# EAGLE schematic Main_Board (EAGLE 6.4)
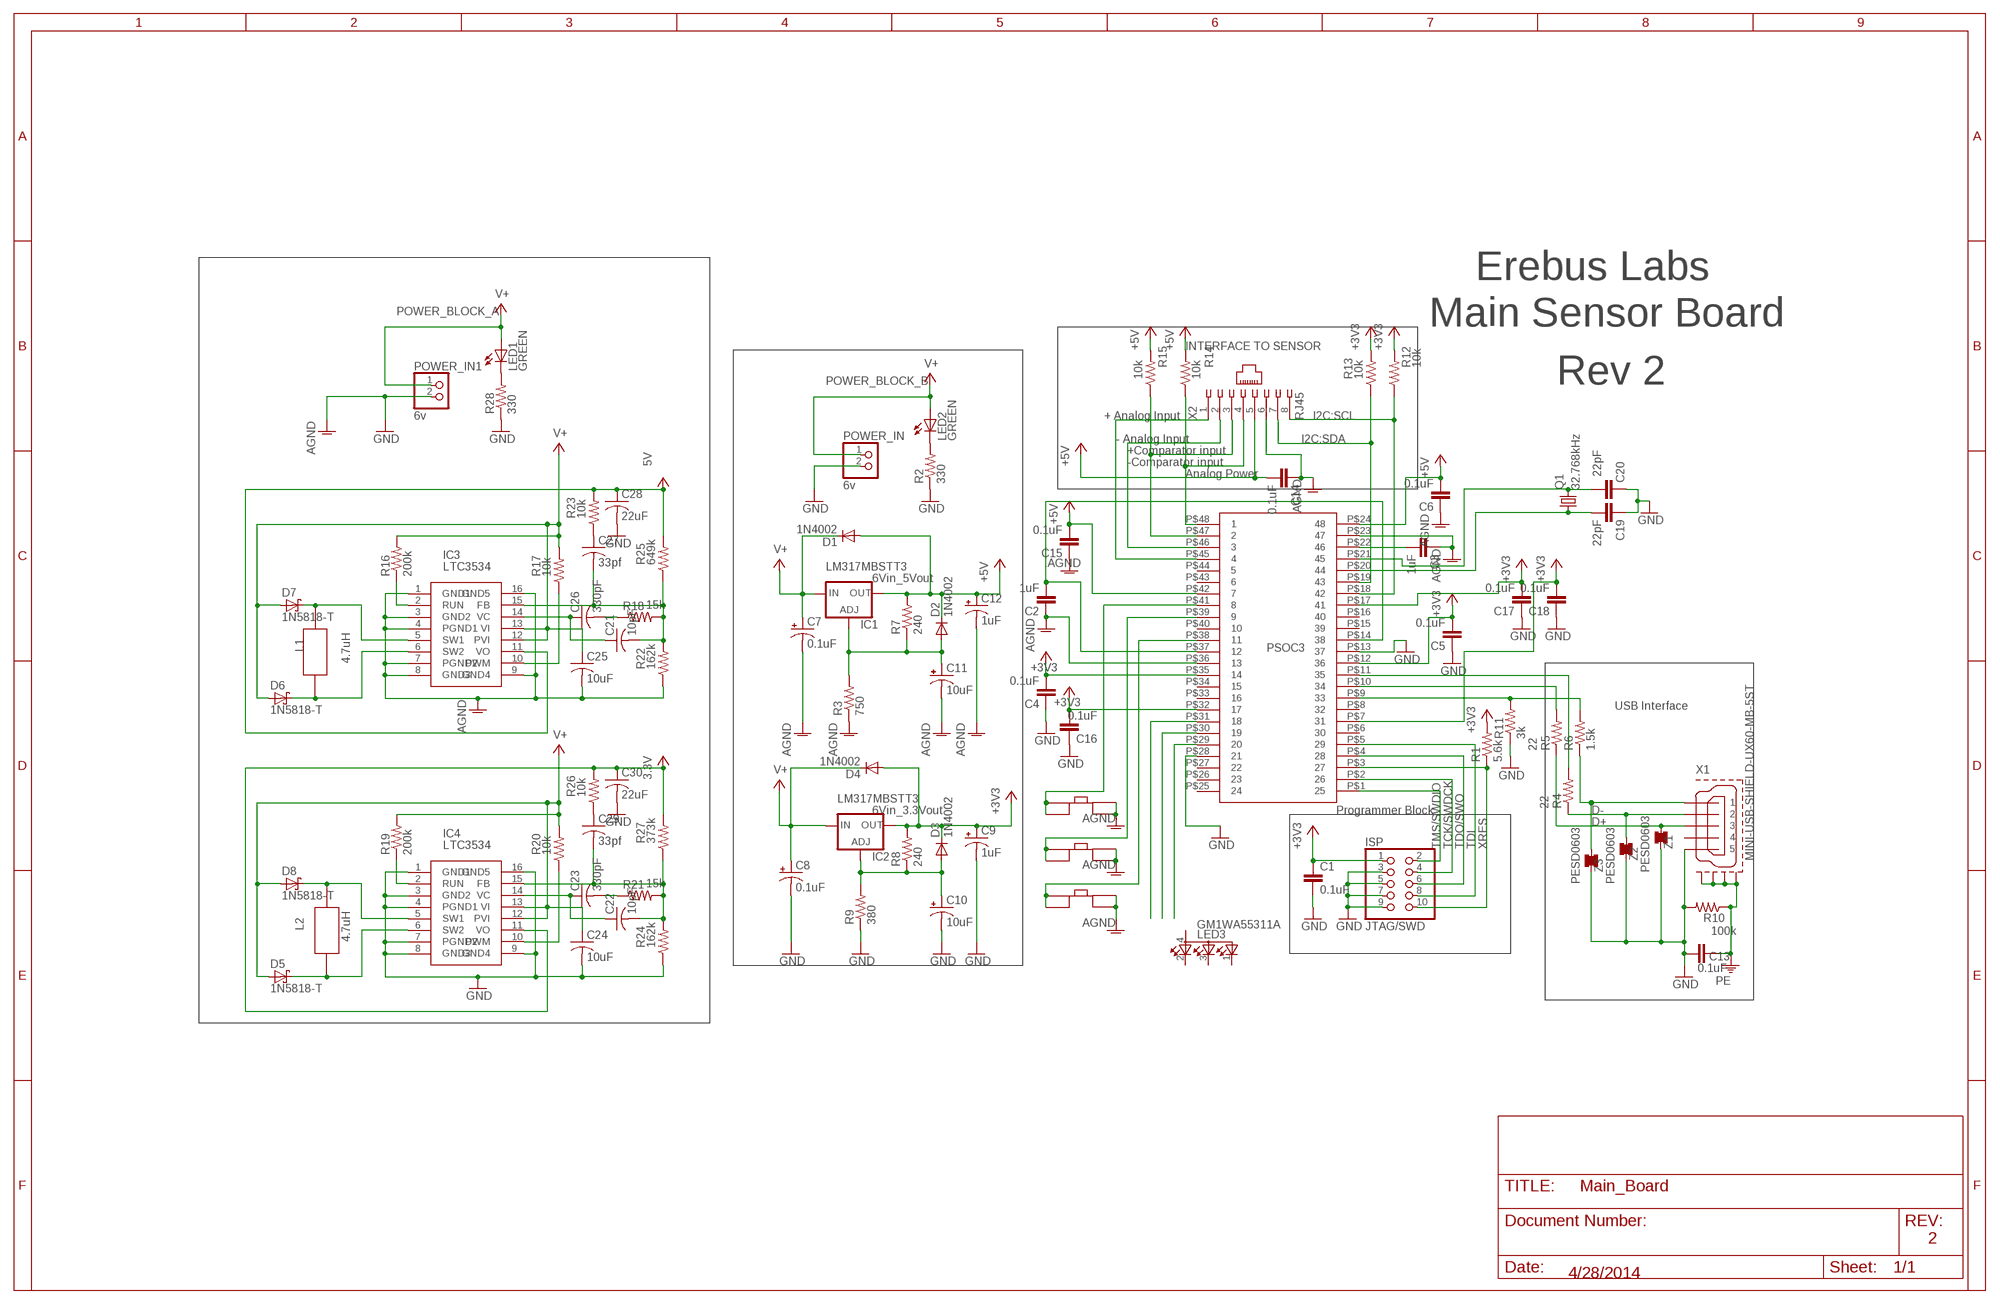
[diagram p0: schematic, sheet 1]

## Parts
C1  0.1uF  C-EUC0603K  [C0603K]
C2  1uF  C-EUC0603  [C0603]
C3  1uF  C-EUC0603  [C0603]
C4  0.1uF  C-EUC0603K  [C0603K]
C5  0.1uF  C-EUC0603K  [C0603K]
C6  0.1uF  C-EUC0603K  [C0603K]
C7  0.1uF  CPOL-USE2-5  [E2-5]
C8  0.1uF  CPOL-USE2-5  [E2-5]
C9  1uF  CPOL-USE2-5  [E2-5]
C10  10uF  CPOL-USE2-5  [E2-5]
C11  10uF  CPOL-USE2-5  [E2-5]
C12  1uF  CPOL-USE2-5  [E2-5]
C13  0.1uF  C-EUC0603K  [C0603K]
C14  0.1uF  C-EUC0603K  [C0603K]
C15  0.1uF  C-EUC0603K  [C0603K]
C16  0.1uF  C-EUC0603K  [C0603K]
C17  0.1uF  C-EUC0603K  [C0603K]
C18  0.1uF  C-EUC0603K  [C0603K]
C19  22pF  C-EUC0603  [C0603]
C20  22pF  C-EUC0603  [C0603]
C21  10pF  C-USC0805  [C0805]
C22  10pF  C-USC0805  [C0805]
C23  330pF  C-USC0805  [C0805]
C24  10uF  C-USC0805  [C0805]
C25  10uF  C-USC0805  [C0805]
C26  330pF  C-USC0805  [C0805]
C27  33pf  C-USC0805  [C0805]
C28  22uF  C-USC0805  [C0805]
C29  33pf  C-USC0805  [C0805]
C30  22uF  C-USC0805  [C0805]
D1  1N4002  DIODE-DO41-7.6  [DO41-7.6]
D2  1N4002  DIODE-DO41-7.6  [DO41-7.6]
D3  1N4002  DIODE-DO41-7.6  [DO41-7.6]
D4  1N4002  DIODE-DO41-7.6  [DO41-7.6]
D5  1N5818-T  [DO41-7.6]
D6  1N5818-T  [DO41-7.6]
D7  1N5818-T  [DO41-7.6]
D8  1N5818-T  [DO41-7.6]
IC1  LM317MBSTT3  [SOT223]
IC2  LM317MBSTT3  [SOT223]
ISP  JTAG/SWD  PINHD-2X5/90  [2X05/90]
L1  4.7uH  SHEILDED_COIL  [SHEILDED_COIL]
L2  4.7uH  SHEILDED_COIL  [SHEILDED_COIL]
LED1  GREEN  LED5MM  [LED5MM]
LED2  GREEN  LED5MM  [LED5MM]
LED3  GM1WA55311A  [GM1WA55311A]
POWER_IN  6v  PINHD-1X2  [1X02]
POWER_IN1  6v  PINHD-1X2  [1X02]
Q1  32.768kHz  CRYSTALTC38H  [TC38H]
R1  5.6k  R-US_R0805  [R0805]
R2  330  R-US_R0603  [R0603]
R3  750  R-US_M1206  [M1206]
R4  22  R-US_R0603  [R0603]
R5  22  R-US_R0603  [R0603]
R6  1.5k  R-US_R0805  [R0805]
R7  240  R-US_M1206  [M1206]
R8  240  R-US_M1206  [M1206]
R9  380  R-US_M1206  [M1206]
R10  100k  R-US_R0805  [R0805]
R11  3k  R-US_R0805  [R0805]
R12  10k  R-US_R0805  [R0805]
R13  10k  R-US_R0805  [R0805]
R14  10k  R-US_R0805  [R0805]
R15  10k  R-US_R0805  [R0805]
R16  200k  R-US_R1206  [R1206]
R17  10k  R-US_R0805  [R0805]
R18  15k  R-US_R0805  [R0805]
R19  200k  R-US_R1206  [R1206]
R20  10k  R-US_R0805  [R0805]
R21  15k  R-US_R0805  [R0805]
R22  162k  R-US_R0805  [R0805]
R23  10k  R-US_R0805  [R0805]
R24  162k  R-US_R0805  [R0805]
R25  649k  R-US_R0805  [R0805]
R26  10k  R-US_R0805  [R0805]
R27  373k  R-US_R0805  [R0805]
R28  330  R-US_R0603  [R0603]
U$1  PSOC_3_48PIN_SSOP  [PSOC_3_48PIN_SSOP]
U$2  SWITCHER  [SSOP16]
U$3  SWITCHER  [SSOP16]
U$4  SPST  [SPST]
U$5  SPST  [SPST]
U$6  SPST  [SPST]
X1  MINI-USB-SHIELD-UX60-MB-5ST  [UX60-MB-5ST]
X2  RJ45  555167-1  [555167-1]
Z1  PESD0603  [SMD-0603]
Z2  PESD0603  [SMD-0603]
Z3  PESD0603  [SMD-0603]

## Nets
+3V3: C1.1 C4.2 C5.2 C9.+ C17.2 C18.2 D3.C D4.A IC2.4(OUT) ISP.1 R1.2 R8.2 R12.2 R13.2 U$1.P$7 U$1.P$12 U$1.P$17 U$1.P$35
+5V: C6.2 C12.+ C14.2 C15.2 C16.2 D1.A D2.C IC1.4(OUT) R7.2 R14.2 R15.2 U$1.P$24 U$1.P$32 U$1.P$42 X2.5 ; supply symbol labelled +3V3
AGND: C13.1 R10.1 U$4.B1 U$4.B2 U$5.B1 U$5.B2 U$6.B1 U$6.B2 X1.M1(GND1) X1.M2(GND2) X1.M3(GND3) X1.M4(GND4) ; supply symbol labelled PE
ANALOGINPUT: U$1.P$46 X2.2
GND: C1.2 C2.1 C3.1 C4.1 C5.1 C6.1 C7.- C8.- C9.- C10.- C11.- C12.- C13.2 C14.1 C15.1 C16.1 C17.1 C18.1 C19.1 C20.1 C24.2 C25.2 C28.2 C30.2 ISP.3 ISP.5 ISP.7 ISP.9 POWER_IN1.2 POWER_IN.2 R2.1 R3.1 R9.1 R10.2 R11.1 R22.1 R24.1 R28.1 U$1.P$13 U$1.P$23 U$1.P$28 U$1.P$36 U$2.1(GND1) U$2.3(GND2) U$2.4(PGND1) U$2.7(PGND2) U$2.8(GND3) U$2.9(GND4) U$2.16(GND5) U$3.1(GND1) U$3.3(GND2) U$3.4(PGND1) U$3.7(PGND2) U$3.8(GND3) U$3.9(GND4) U$3.16(GND5) X1.5 X2.6 Z1.1 Z2.1 Z3.1 ; supply symbol labelled AGND
N$1: R4.2 U$1.P$11
N$2: R5.2 U$1.P$10
N$3: R6.2 R11.2 U$1.P$9
N$4: ISP.2 U$1.P$1
N$5: ISP.4 U$1.P$2
N$6: ISP.6 U$1.P$4
N$7: ISP.8 U$1.P$5
N$8: ISP.10 R1.1 U$1.P$3
N$9: C2.2 U$1.P$14 U$1.P$37
N$10: C11.+ D2.A IC1.1(ADJ) R3.2 R7.1
N$11: C3.2 U$1.P$22
N$12: LED2.K(C) R2.2
N$13: R5.1 X1.3 Z1.2
N$14: R4.1 X1.2 Z2.2
N$15: C10.+ D3.A IC2.1(ADJ) R8.1 R9.2
N$16: C20.2 Q1.2 U$1.P$21
N$17: R6.1 X1.1 Z3.2
N$18: R15.1 U$1.P$47 X2.3
N$19: R14.1 U$1.P$48 X2.4
N$20: R13.1 U$1.P$19 X2.7
N$21: R12.1 U$1.P$18 X2.8
N$23: C19.2 Q1.1 U$1.P$20
N$24: C21.1 C26.1 U$2.14(VC)
N$25: R16.1 U$2.2(RUN)
N$26: D7.C L1.P$2 U$2.5(SW1)
N$27: R17.1 U$2.10(PWM)
N$28: D6.C L1.P$1 U$2.6(SW2)
N$29: C26.2 R18.1
N$30: C21.2 C27.2 R18.2 R22.2 R25.1 U$2.15(FB)
N$31: C27.1 R23.1
N$32: R19.1 U$3.2(RUN)
N$33: R20.1 U$3.10(PWM)
N$34: D8.C L2.P$2 U$3.5(SW1)
N$35: D5.C L2.P$1 U$3.6(SW2)
N$36: C22.1 C23.1 U$3.14(VC)
N$37: C23.2 R21.1
N$38: C22.2 C29.2 R21.2 R24.2 R27.1 U$3.15(FB)
N$39: C29.1 R26.1
N$40: LED1.K(C) R28.2
N$41: U$1.P$39 U$5.A1 U$5.A2
N$42: U$1.P$45 X2.1
N$43: U$1.P$31
N$44: U$1.P$38 U$6.A1 U$6.A2
N$45: U$1.P$41 U$4.A1 U$4.A2
N$46: U$1.P$30
N$47: U$1.P$29
V+: C7.+ C8.+ C24.1 C25.1 C28.1 C30.1 D1.C D4.C D5.A D6.A D7.A D8.A IC1.3(IN) IC2.3(IN) LED1.A LED2.A POWER_IN1.1 POWER_IN.1 R16.2 R17.2 R19.2 R20.2 R23.2 R25.2 R26.2 R27.2 U$2.11(VO) U$2.12(PVI) U$2.13(VI) U$3.11(VO) U$3.12(PVI) U$3.13(VI) ; supply symbol labelled 5V, 3.3V
Unconnected: LED3.1(CGREEN) LED3.2(CRED) LED3.3(CBLUE) LED3.4(A) U$1.P$6 U$1.P$8 U$1.P$15 U$1.P$16 U$1.P$25 U$1.P$26 U$1.P$27 U$1.P$33 U$1.P$34 U$1.P$40 U$1.P$43 U$1.P$44 X1.4

## Notes on the sheet
- Erebus Labs
- POWER_BLOCK_A
- Main Sensor Board
- INTERFACE TO SENSOR
- POWER_BLOCK_B | Rev 2
- + Analog Input | I2C:SCL
- - Analog Input | I2C:SDA
- +Comparator input
- -Comparator input
- Analog Power
- IC3
- LTC3534
- 6Vin_5Vout
- L1 | PSOC3
- 4.7uH
- USB Interface
- 6Vin_3.3Vout | Programmer Block | D-
- D+
- IC4
- LTC3534 | TMS/SWDIO | TCK/SWDCK | TDO/SWO | TDI | XRES
- L2
- 4.7uH
- 2
- 4/28/2014

## Library data of the parts
C1-C6 C13-C20 = rcl:C-EU: CAPACITOR, European symbol
C7-C12 = rcl:CPOL-US: POLARIZED CAPACITOR, American symbol
C21-C30 = rcl:C-US: CAPACITOR, American symbol
D1-D4 = diode:DIODE-: DIODE
D5-D8 = diode:1N581*: 1.0A SCHOTTKY BARRIER RECTIFIER Source: http://www.diodes.com/datasheets/ds23001.pdf
IC1 IC2 = v-reg:LM317?*: 500 mA Adjustable Output Positive Voltage Regulator Source: http://www.onsemi.co.jp .. LM317M-D.PDF
ISP = pinhead:PINHD-2X5: PIN HEADER
L1 L2 = Inductor:SHEILDED_COIL
LED1 LED2 = led:LED: LED OSRAM: - CHIPLED LG R971, LG N971, LY N971, LG Q971, LY Q971, LO R971, LY R971 LH N974, LH R974 LS Q976, LO Q976, LY Q976 LO Q996 - Hyper CHIPLED LW Q18S LB Q993, LB Q99A, LB R99A - SideLED LS A670, LO A670, LY A670, LG A670, LP A670 LB A673, LV A673, LT A673, LW A673 LH A674 LY A675 LS A676, LA A676, LO A676, LY A676, LW A676 LS A679, LY A679, LG A679 - Hyper Micro SIDELED® LS Y876, LA Y876, LO Y876, LY Y876 LT Y87S - SmartLED LW L88C, LW L88S LB L89C, LB L89S, LG L890 LS L89K, LO L89K, LY L89K LS L896, LA L896, LO L896, LY L896 - TOPLED LS T670, LO T670, LY T670, LG T670, LP T670 LSG T670, LSP T670, LSY T670, LOP T670, LYG T670 LG T671, LOG T671, LSG T671 LB T673, LV T673, LT T673, LW T673 LH T674 LS T676, LA T676, LO T676, LY T676, LB T676, LH T676, LSB T676, LW T676 LB T67C, LV T67C, LT T67C, LS T67K, LO T67K, LY T67K, LW E67C LS E67B, LA E67B, LO E67B, LY E67B, LB E67C, LV E67C, LT E67C LW T67C LS T679, LY T679, LG T679 LS T770, LO T770, LY T770, LG T770, LP T770 LB T773, LV T773, LT T773, LW T773 LH T774 LS E675, LA E675, LY E675, LS T675 LS T776, LA T776, LO T776, LY T776, LB T776 LHGB T686 LT T68C, LB T68C - Hyper Mini TOPLED® LB M676 - Mini TOPLED Santana® LG M470 LS M47K, LO M47K, LY M47K Source: http://www.osram.convergy.de LUXEON: - LUMILED® LXK2-PW12-R00, LXK2-PW12-S00, LXK2-PW14-U00, LXK2-PW14-V00 LXK2-PM12-R00, LXK2-PM12-S00, LXK2-PM14-U00 LXK2-PE12-Q00, LXK2-PE12-R00, LXK2-PE12-S00, LXK2-PE14-T00, LXK2-PE14-U00 LXK2-PB12-K00, LXK2-PB12-L00, LXK2-PB12-M00, LXK2-PB14-N00, LXK2-PB14-P00, LXK2-PB14-Q00 LXK2-PR12-L00, LXK2-PR12-M00, LXK2-PR14-Q00, LXK2-PR14-R00 LXK2-PD12-Q00, LXK2-PD12-R00, LXK2-PD12-S00 LXK2-PH12-R00, LXK2-PH12-S00 LXK2-PL12-P00, LXK2-PL12-Q00, LXK2-PL12-R00 Source: www.luxeon.com KINGBRIGHT: KA-3528ASYC Source: www.kingbright.com
LED3 = led:GM1WA55311A: Chip LED RGB Source: http://document.sharpsma.com/files/GM1WA55311A_SS.pdf
POWER_IN POWER_IN1 = pinhead:PINHD-1X2: PIN HEADER
Q1 = crystal:CRYSTAL: CRYSTAL; OC_FARNELL: unknown; OC_NEWARK: unknown
R1-R15 R17 R18 R20-R28 = rcl:R-US_: RESISTOR, American symbol
R16 R19 = resistor:R-US_: RESISTOR, American symbol
U$1 = PSOC_48SSOP:PSOC_3_48PIN_SSOP
U$2 U$3 = linear-technology-2:SWITCHER
U$4-U$6 = Switches_SPST:SPST
X1 = usb_con-update:MINI-USB-SHIELD-: MINI USB Connector Source: http://www.hirose.co.jp/cataloge_hp/e24000019.pdf
X2 = con-amp:555167-1: AMP connector
Z1-Z3 = supressor:PESD: ESD SUPPRESSOR Polymeric ESD Suppressor, Raychem PESD Series